# EAGLE schematic ControlBoard (EAGLE 9.6.2)
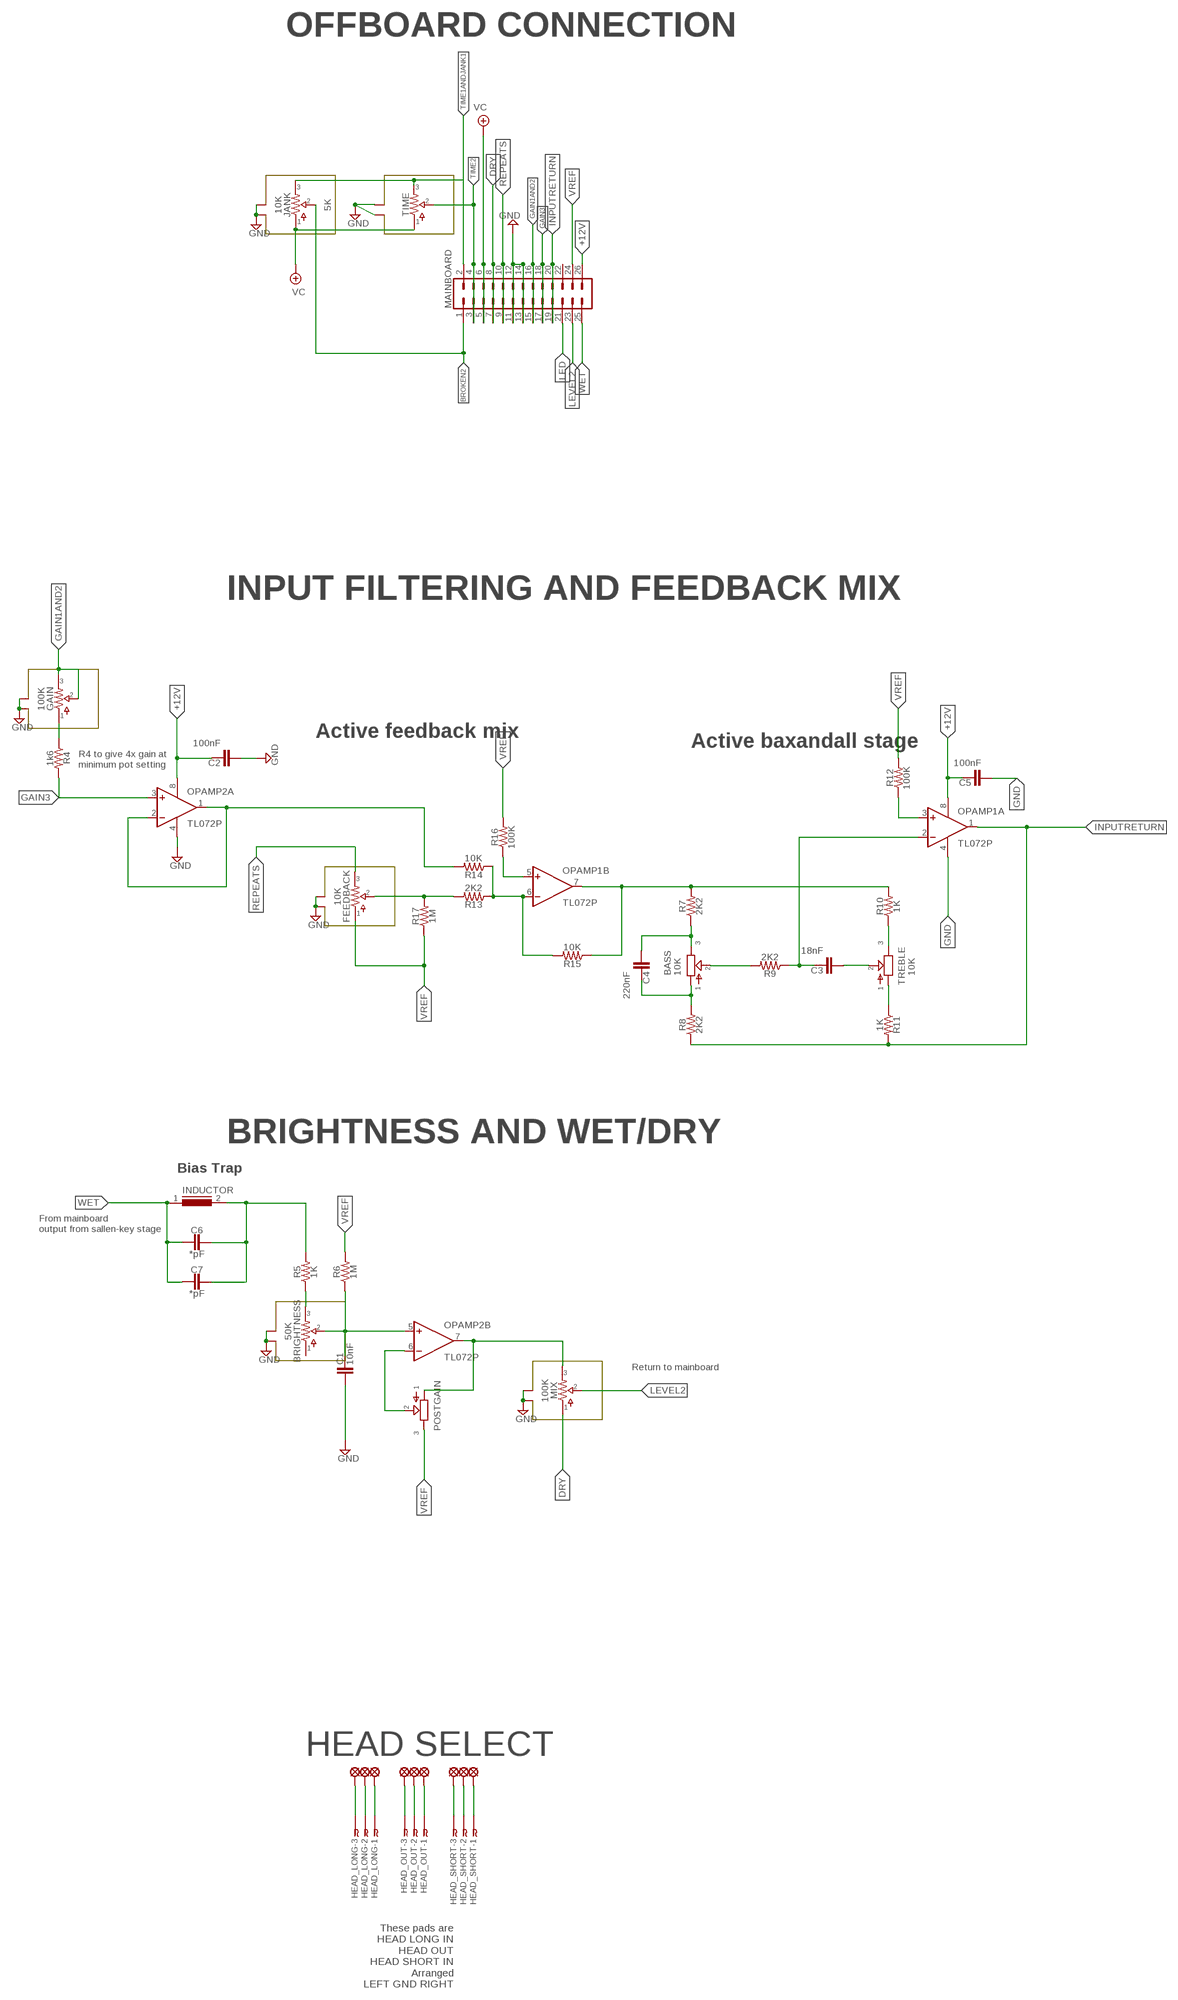
[diagram p0: schematic, sheet 1]

## Parts
BASS  10K  POT-EU375  [B375P]
BRIGHTNESS  50K  9MM.1  [9MM_METAL_SHAFT]
C1  10nF  CAP.5  [.33UF+]
C2  100nF  CAP.2  [5MM]
C3  18nF  CAP.5  [.33UF+]
C4  220nF  CAP.5  [.33UF+]
C5  100nF  CAP.2  [5MM]
C6  *pF  CAP.5  [.33UF+]
C7  *pF  CAP.5  [.33UF+]
FEEDBACK  10K  9MM.1  [9MM_METAL_SHAFT]
GAIN  100K  9MM.1  [9MM_METAL_SHAFT]
HEAD_LONG  03-JST-B3B-XH-A  [B3B-XH]
HEAD_OUT  03-JST-B3B-XH-A  [B3B-XH]
HEAD_SHORT  03-JST-B3B-XH-A  [B3B-XH]
HIN_1  SE14  [SE14]
HIN_2  SE14  [SE14]
HIN_3  SE14  [SE14]
HIN_4  SE14  [SE14]
HIN_5  SE14  [SE14]
HIN_6  SE14  [SE14]
HOUT_1  SE14  [SE14]
HOUT_2  SE14  [SE14]
HOUT_3  SE14  [SE14]
INDUCTOR  82114R  [82114R]
JANK  10K  9MM.1  [9MM_METAL_SHAFT]
MAINBOARD  CONN_13X22X13  [2X13]
MIX  100K  9MM.1  [9MM_METAL_SHAFT]
OPAMP1  TL072P  [DIL08]
OPAMP2  TL072P  [DIL08]
POSTGAIN  POT-EU375  [B375P]
R4  1k6  R.3B  [7.5MM.2]
R5  1K  R.3B  [7.5MM.2]
R6  1M  R.3B  [7.5MM.2]
R7  2K2  R.3B  [7.5MM.2]
R8  2K2  R.3B  [7.5MM.2]
R9  2K2  R.3B  [7.5MM.2]
R10  1K  R.3B  [7.5MM.2]
R11  1K  R.3B  [7.5MM.2]
R12  100K  R.3B  [7.5MM.2]
R13  2K2  R.3B  [7.5MM.2]
R14  10K  R.3B  [7.5MM.2]
R15  10K  R.3B  [7.5MM.2]
R16  100K  R.3B  [7.5MM.2]
R17  1M  R.3B  [7.5MM.2]
TIME  5K  9MM.1  [9MM_METAL_SHAFT]
TREBLE  10K  POT-EU375  [B375P]

## Nets
+12V: C2.1 C5.1 MAINBOARD.26 OPAMP1.8(P:V+) OPAMP2.8(P:V+)
BIAS: C6.1 C7.1 INDUCTOR.2 R5.2
BRIGHTNESS2: OPAMP2.1(A:OUT) OPAMP2.2(A:-IN) R14.2
BROKEN2: JANK.P$2 MAINBOARD.1
DRY: MAINBOARD.7 MAINBOARD.8 MIX.P$1
GAIN1AND2: GAIN.P$2 GAIN.P$3 MAINBOARD.15 MAINBOARD.16
GAIN3: MAINBOARD.17 MAINBOARD.18 OPAMP2.3(A:+IN) R4.2
GND: BRIGHTNESS.P$4(CHAS$1) BRIGHTNESS.P$5(CHAS$2) C1.2 C2.2 C5.2 FEEDBACK.P$4(CHAS$1) FEEDBACK.P$5(CHAS$2) GAIN.P$4(CHAS$1) GAIN.P$5(CHAS$2) JANK.P$4(CHAS$1) JANK.P$5(CHAS$2) MAINBOARD.11 MAINBOARD.12 MAINBOARD.13 MAINBOARD.14 MIX.P$4(CHAS$1) MIX.P$5(CHAS$2) OPAMP1.4(P:V-) OPAMP2.4(P:V-) TIME.P$4(CHAS$1) TIME.P$5(CHAS$2)
INPUTRETURN: MAINBOARD.19 MAINBOARD.20 OPAMP1.1(A:OUT) R8.1 R11.2
LED: MAINBOARD.21
LEVEL2: MAINBOARD.23 MIX.P$2
N$1: BRIGHTNESS.P$2 C1.1 OPAMP2.5(B:+IN) R6.1
N$2: HEAD_LONG.P$3 HIN_4.MP
N$3: BASS.2 R9.2
N$4: R10.1 TREBLE.3
N$5: C3.2 TREBLE.2
N$6: HEAD_LONG.P$2 HIN_5.MP
N$7: HEAD_LONG.P$1 HIN_6.MP
N$8: HEAD_OUT.P$3 HOUT_1.MP
N$9: BRIGHTNESS.P$3 R5.1
N$10: HEAD_OUT.P$2 HOUT_2.MP
N$11: HEAD_OUT.P$1 HOUT_3.MP
N$12: OPAMP2.6(B:-IN) POSTGAIN.2
N$13: MIX.P$3 OPAMP2.7(B:OUT) POSTGAIN.1
N$14: HEAD_SHORT.P$3 HIN_1.MP
N$15: BASS.3 C4.2 R7.1
N$16: BASS.1 C4.1 R8.2
N$17: R11.1 TREBLE.1
N$20: FEEDBACK.P$2 R13.2 R17.2
N$21: C3.1 OPAMP1.2(A:-IN) R9.1
N$23: OPAMP1.3(A:+IN) R12.1
N$24: OPAMP1.6(B:-IN) R13.1 R14.1 R15.2
N$25: OPAMP1.5(B:+IN) R16.1
N$26: HEAD_SHORT.P$2 HIN_2.MP
N$27: HEAD_SHORT.P$1 HIN_3.MP
N$28: GAIN.P$1 R4.1
N$29: OPAMP1.7(B:OUT) R7.2 R10.2 R15.1
REPEATS: FEEDBACK.P$3 MAINBOARD.9 MAINBOARD.10
TIME1ANDJANK1: JANK.P$3 MAINBOARD.2 TIME.P$3
TIME2: MAINBOARD.3 MAINBOARD.4 TIME.P$2
VC: JANK.P$1 MAINBOARD.5 MAINBOARD.6 TIME.P$1
VREF: FEEDBACK.P$1 MAINBOARD.24 POSTGAIN.3 R6.2 R12.2 R16.2 R17.1
WET: C6.2 C7.2 INDUCTOR.1 MAINBOARD.25
Unconnected: BRIGHTNESS.P$1 MAINBOARD.22

## Notes on the sheet
- OFFBOARD CONNECTION
- INPUT FILTERING AND FEEDBACK MIX
- Active feedback mix
- Active baxandall stage
- R4 to give 4x gain at 
  minimum pot setting
- BRIGHTNESS AND WET/DRY
- Bias Trap
- From mainboard
  output from sallen-key stage
- Return to mainboard
- HEAD SELECT
- These pads are
  HEAD LONG IN
  HEAD OUT
  HEAD SHORT IN
  Arranged
  LEFT GND RIGHT

## Library data of the parts
BASS POSTGAIN TREBLE = gm-pots:POT-EU
BRIGHTNESS FEEDBACK GAIN JANK MIX TIME = potentiometers:9MM: 9mm Potentiometers
C1-C7 = capacitors-film:CAP: For Ceramic, Film, MLCC caps
HEAD_LONG HEAD_OUT HEAD_SHORT = bt_con-jst-xh:03-JST: JST CONNECTOR
HIN_1-HIN_6 HOUT_1-HOUT_3 = solpad:SE14: SOLDER PAD E1553, drill 1,4mm, distributor Buerklin, 07F820
INDUCTOR = inductors:82114R: INDUCTOR; SPICEPREFIX: L
MAINBOARD = SparkFun-Connectors:CONN_13X2: Multi connection point. Often used as Generic Header-pin footprint for 0.1 inch spaced/style header connections On any of the 0.1 inch spaced packages, you can populate with these: Break Away Headers - Straight <https://www.sparkfun.com/products/116> (PRT-00116) Break Away Male Headers - Right Angle <https://www.sparkfun.com/products/553> (PRT-00553) Female Headers <https://www.sparkfun.com/products/115> (PRT-00115) Break Away Headers - Machine Pin <https://www.sparkfun.com/products/117> (PRT-00117) Break Away Female Headers - Swiss Machine Pin <https://www.sparkfun.com/products/743> (PRT-00743)
OPAMP1 OPAMP2 = AdamsStuff:TL072: OP AMP
R4-R17 = resistors:R: 1/8W, 1/4W and 1W resistors